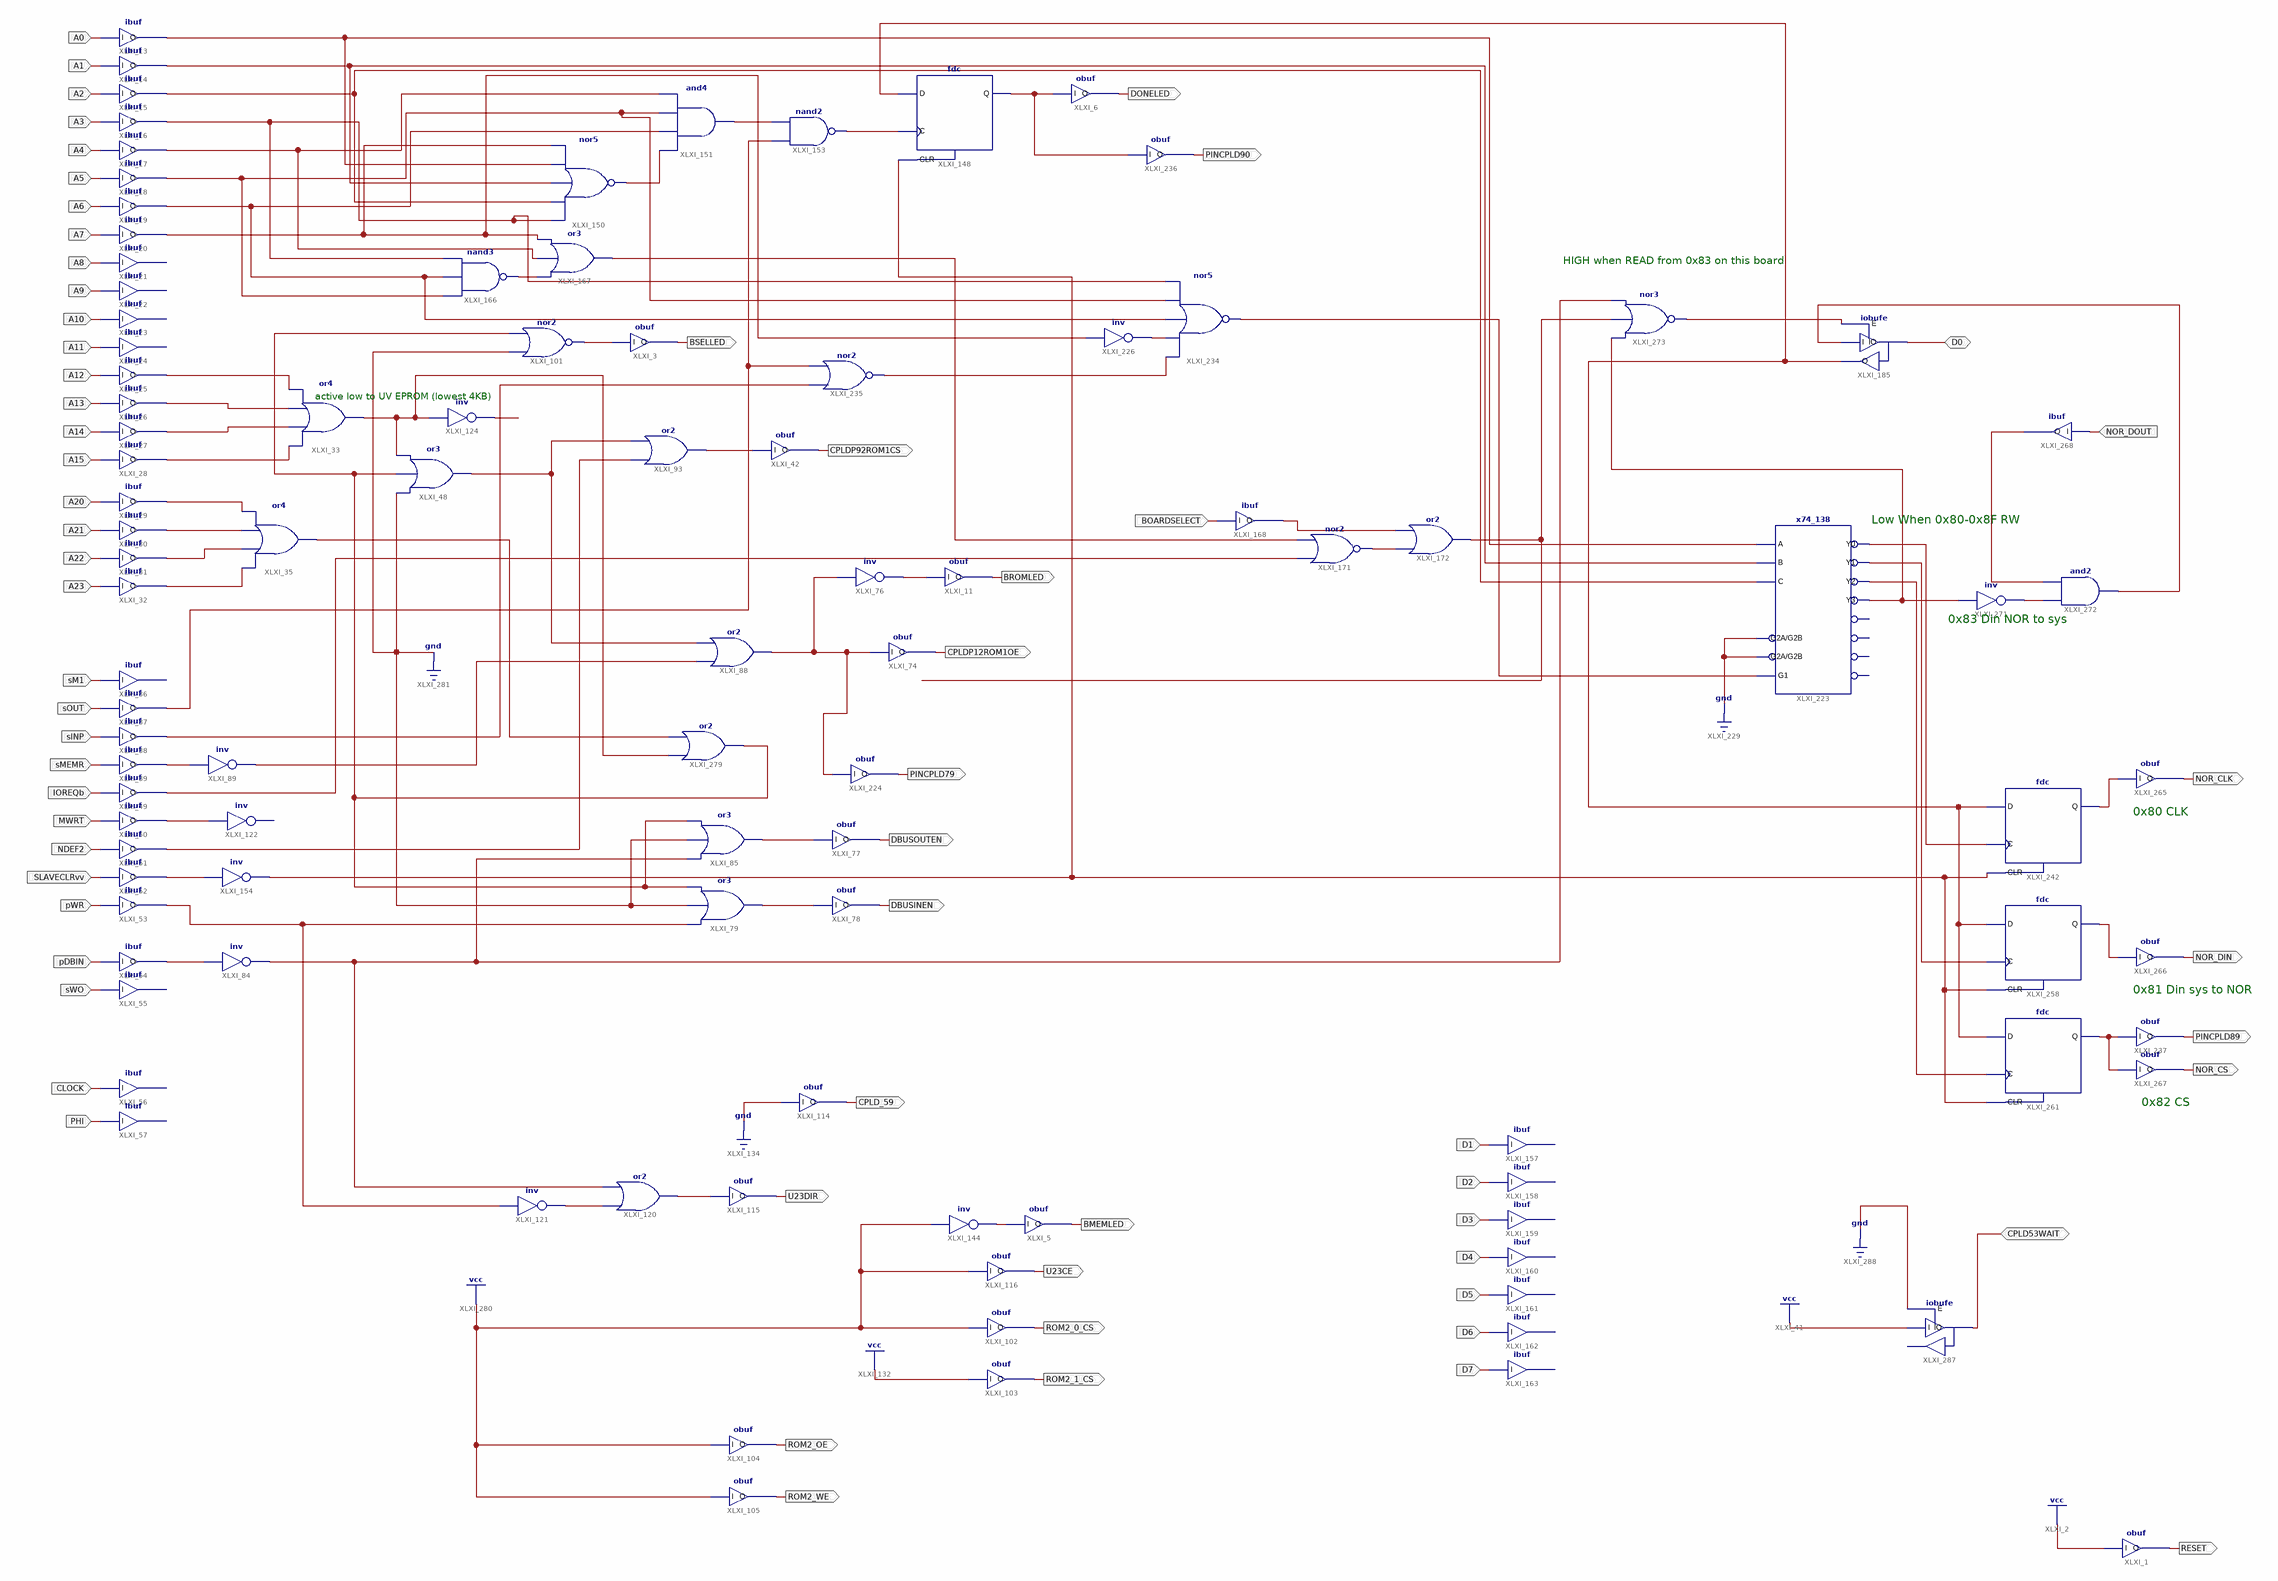
[diagram p0: schematic sheet 1]
// Xilinx ISE schematic U11v2.sch (xc9500xl) as structural Verilog: 102 symbols, 66 ports
module U11v2 (
  input  A0,
  input  A1,
  input  A2,
  input  A3,
  input  A4,
  input  A5,
  input  A6,
  input  A7,
  input  A8,
  input  A9,
  input  A10,
  input  A11,
  input  A12,
  input  A13,
  input  A14,
  input  A15,
  input  A20,
  input  A21,
  input  A22,
  input  A23,
  input  sM1,
  input  sOUT,
  input  sINP,
  input  sMEMR,
  input  IOREQb,
  input  MWRT,
  input  NDEF2,
  input  SLAVECLRvv,
  input  pWR,
  input  pDBIN,
  input  sWO,
  input  PHI,
  input  CLOCK,
  input  BOARDSELECT,
  input  D1,
  input  D2,
  input  D3,
  input  D4,
  input  D5,
  input  D6,
  input  D7,
  input  NOR_DOUT,
  inout  D0,
  inout  CPLD53WAIT,
  output DBUSINEN,
  output DBUSOUTEN,
  output CPLDP12ROM1OE,
  output BROMLED,
  output CPLDP92ROM1CS,
  output BSELLED,
  output ROM2_OE,
  output ROM2_WE,
  output U23DIR,
  output ROM2_0_CS,
  output ROM2_1_CS,
  output CPLD_59,
  output U23CE,
  output BMEMLED,
  output DONELED,
  output RESET,
  output PINCPLD89,
  output NOR_CLK,
  output NOR_DIN,
  output NOR_CS,
  output PINCPLD79,
  output PINCPLD90
);

  wire XLXN_35, XLXN_36, XLXN_37, XLXN_38, XLXN_40, XLXN_41, XLXN_42, XLXN_43, XLXN_59, XLXN_92, XLXN_98,
       XLXN_103, XLXN_105, XLXN_111, XLXN_112, XLXN_121, XLXN_122, XLXN_130, XLXN_149, XLXN_150, XLXN_151,
       XLXN_152, XLXN_153, XLXN_156, XLXN_161, XLXN_185, XLXN_188, XLXN_190, XLXN_191, XLXN_193, XLXN_194,
       XLXN_195, XLXN_196, XLXN_197, XLXN_213, XLXN_215, XLXN_217, XLXN_219, XLXN_222, XLXN_223, XLXN_224,
       XLXN_264, XLXN_265, XLXN_266, XLXN_274, XLXN_285, XLXN_286, XLXN_287, XLXN_320, XLXN_325, XLXN_327,
       XLXN_328, XLXN_329, XLXN_334, XLXN_335, XLXN_342, XLXN_343, XLXN_344, XLXN_345, XLXN_346, XLXN_347,
       XLXN_357, XLXN_366, XLXN_367, XLXN_368, XLXN_373;

  ibuf XLXI_13 (.I(A0), .O(XLXN_264));
  ibuf XLXI_14 (.I(A1), .O(XLXN_191));
  ibuf XLXI_15 (.I(A2), .O(XLXN_190));
  ibuf XLXI_16 (.I(A3), .O(XLXN_215));
  ibuf XLXI_17 (.I(A4), .O(XLXN_188));
  ibuf XLXI_18 (.I(A5), .O(XLXN_217));
  ibuf XLXI_19 (.I(A6), .O(XLXN_265));
  ibuf XLXI_20 (.I(A7), .O(XLXN_193));
  ibuf XLXI_21 (.I(A8));  // open: O
  ibuf XLXI_22 (.I(A9));  // open: O
  ibuf XLXI_23 (.I(A10));  // open: O
  ibuf XLXI_24 (.I(A11));  // open: O
  ibuf XLXI_25 (.I(A12), .O(XLXN_38));
  ibuf XLXI_26 (.I(A13), .O(XLXN_37));
  ibuf XLXI_27 (.I(A14), .O(XLXN_36));
  ibuf XLXI_28 (.I(A15), .O(XLXN_35));
  ibuf XLXI_29 (.I(A20), .O(XLXN_40));
  ibuf XLXI_30 (.I(A21), .O(XLXN_41));
  ibuf XLXI_31 (.I(A22), .O(XLXN_42));
  ibuf XLXI_32 (.I(A23), .O(XLXN_43));
  or XLXI_33 (XLXN_59, XLXN_35, XLXN_36, XLXN_37, XLXN_38);
  or XLXI_35 (XLXN_357, XLXN_43, XLXN_42, XLXN_41, XLXN_40);
  ibuf XLXI_36 (.I(sM1));  // open: O
  ibuf XLXI_37 (.I(sOUT), .O(XLXN_195));
  ibuf XLXI_38 (.I(sINP), .O(XLXN_287));
  ibuf XLXI_39 (.I(sMEMR), .O(XLXN_111));
  or XLXI_48 (XLXN_122, 1'b0, XLXN_368, XLXN_59);
  ibuf XLXI_49 (.I(IOREQb), .O(XLXN_222));
  ibuf XLXI_50 (.I(MWRT), .O(XLXN_153));
  ibuf XLXI_51 (.I(NDEF2), .O(XLXN_156));
  ibuf XLXI_52 (.I(SLAVECLRvv), .O(XLXN_197));
  ibuf XLXI_53 (.I(pWR), .O(XLXN_149));
  obuf XLXI_78 (.I(XLXN_98), .O(DBUSINEN));
  or XLXI_79 (XLXN_98, XLXN_149, 1'b0, XLXN_368);
  ibuf XLXI_54 (.I(pDBIN), .O(XLXN_103));
  ibuf XLXI_55 (.I(sWO));  // open: O
  ibuf XLXI_57 (.I(PHI));  // open: O
  not XLXI_84 (XLXN_150, XLXN_103);
  or XLXI_85 (XLXN_105, XLXN_150, 1'b0, XLXN_368);
  obuf XLXI_77 (.I(XLXN_105), .O(DBUSOUTEN));
  obuf XLXI_74 (.I(XLXN_366), .O(CPLDP12ROM1OE));
  or XLXI_88 (XLXN_366, XLXN_112, XLXN_122);
  not XLXI_89 (XLXN_112, XLXN_111);
  obuf XLXI_11 (.I(XLXN_92), .O(BROMLED));
  not XLXI_76 (XLXN_92, XLXN_366);
  ibuf XLXI_56 (.I(CLOCK));  // open: O
  or XLXI_93 (XLXN_121, XLXN_156, XLXN_122);
  obuf XLXI_42 (.I(XLXN_121), .O(CPLDP92ROM1CS));
  obuf XLXI_3 (.I(XLXN_130), .O(BSELLED));
  nor XLXI_101 (XLXN_130, 1'b0, XLXN_368);
  obuf XLXI_104 (.I(1'b1), .O(ROM2_OE));
  obuf XLXI_105 (.I(1'b1), .O(ROM2_WE));
  obuf XLXI_115 (.I(XLXN_152), .O(U23DIR));
  or XLXI_120 (XLXN_152, XLXN_151, XLXN_150);
  not XLXI_121 (XLXN_151, XLXN_149);
  // inv XLXI_122 has open pins: I=XLXN_153, O=open
  not XLXI_124 (XLXN_161, XLXN_59);
  obuf XLXI_102 (.I(1'b1), .O(ROM2_0_CS));
  obuf XLXI_103 (.I(1'b1), .O(ROM2_1_CS));
  obuf XLXI_114 (.I(1'b0), .O(CPLD_59));
  obuf XLXI_116 (.I(1'b1), .O(U23CE));
  obuf XLXI_5 (.I(XLXN_274), .O(BMEMLED));
  not XLXI_144 (XLXN_274, 1'b1);
  fdc XLXI_148 (.C(XLXN_196), .CLR(XLXN_320), .D(XLXN_325), .Q(XLXN_334));
  nor XLXI_150 (XLXN_185, XLXN_215, XLXN_190, XLXN_191, XLXN_264, XLXN_193);
  and XLXI_151 (XLXN_194, XLXN_185, XLXN_265, XLXN_217, XLXN_188);
  nand XLXI_153 (XLXN_196, XLXN_195, XLXN_194);
  not XLXI_154 (XLXN_320, XLXN_197);
  obuf XLXI_6 (.I(XLXN_334), .O(DONELED));
  nand XLXI_166 (XLXN_213, XLXN_217, XLXN_265, XLXN_215);
  or XLXI_167 (XLXN_219, XLXN_213, XLXN_188, XLXN_193);
  ibuf XLXI_168 (.I(BOARDSELECT), .O(XLXN_223));
  nor XLXI_171 (XLXN_224, XLXN_222, XLXN_219);
  or XLXI_172 (XLXN_367, XLXN_224, XLXN_223);
  iobufe XLXI_185 (.I(XLXN_346), .IO(D0), .O(XLXN_325), .E(XLXN_345));
  x74_138 XLXI_223 (
    .A(XLXN_264), .B(XLXN_191), .C(XLXN_190), .G1(XLXN_285), .G2A(1'b0), .G2B(1'b0), .Y0(XLXN_327),
    .Y1(XLXN_328), .Y2(XLXN_329), .Y3(XLXN_344));  // open: Y4, Y5, Y6, Y7
  ibuf XLXI_157 (.I(D1));  // open: O
  ibuf XLXI_158 (.I(D2));  // open: O
  ibuf XLXI_159 (.I(D3));  // open: O
  ibuf XLXI_160 (.I(D4));  // open: O
  ibuf XLXI_161 (.I(D5));  // open: O
  ibuf XLXI_162 (.I(D6));  // open: O
  ibuf XLXI_163 (.I(D7));  // open: O
  not XLXI_226 (XLXN_266, XLXN_193);
  nor XLXI_234 (XLXN_285, XLXN_286, XLXN_266, XLXN_265, XLXN_217, XLXN_215);
  nor XLXI_235 (XLXN_286, XLXN_287, XLXN_195);
  obuf XLXI_1 (.I(1'b1), .O(RESET));
  fdc XLXI_242 (.C(XLXN_327), .CLR(XLXN_320), .D(XLXN_325), .Q(XLXN_347));
  fdc XLXI_258 (.C(XLXN_328), .CLR(XLXN_320), .D(XLXN_325), .Q(XLXN_373));
  fdc XLXI_261 (.C(XLXN_329), .CLR(XLXN_320), .D(XLXN_325), .Q(XLXN_335));
  obuf XLXI_237 (.I(XLXN_335), .O(PINCPLD89));
  obuf XLXI_265 (.I(XLXN_347), .O(NOR_CLK));
  obuf XLXI_266 (.I(XLXN_373), .O(NOR_DIN));
  obuf XLXI_267 (.I(XLXN_335), .O(NOR_CS));
  ibuf XLXI_268 (.I(NOR_DOUT), .O(XLXN_343));
  not XLXI_271 (XLXN_342, XLXN_344);
  and XLXI_272 (XLXN_346, XLXN_342, XLXN_343);
  nor XLXI_273 (XLXN_345, XLXN_344, XLXN_367, XLXN_150);
  obuf XLXI_224 (.I(XLXN_366), .O(PINCPLD79));
  or XLXI_279 (XLXN_368, XLXN_59, XLXN_357);
  obuf XLXI_236 (.I(XLXN_334), .O(PINCPLD90));
  iobufe XLXI_287 (.I(1'b1), .IO(CPLD53WAIT), .E(1'b0));  // open: O

  // Notes on the sheet:
  //   HIGH when READ from 0x83 on this board
  //   active low to UV EPROM (lowest 4KB)
  //   Low When 0x80-0x8F RW
  //   0x83 Din NOR to sys
  //   0x80 CLK
  //   0x81 Din sys to NOR
  //   0x82 CS
endmodule
